# EAGLE design Slave-Mega (EAGLE 9.6.2)
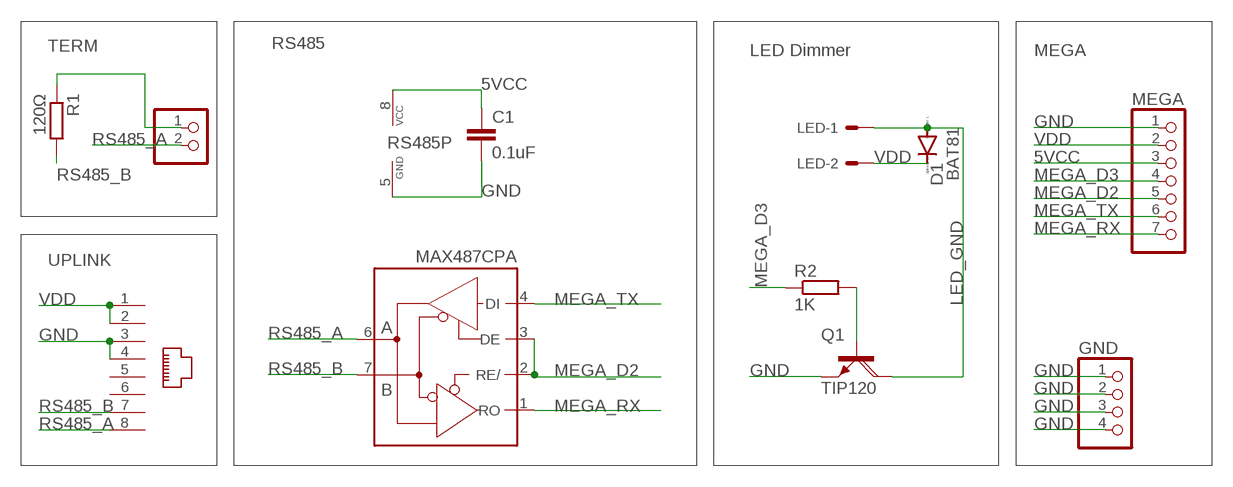
[diagram p0: schematic, sheet 1]

## Parts
C1  0.1uF  C-EU025-025X050  [C025-025X050]
D1  BAT81  [DO34-7]
GND  PINHD-1X4  [1X04]
LED  KK-156-2  [KK-156-2]
MEGA  PINHD-1X7  [1X07]
Q1  TIP120  [TO220AH]
R1  120Ω  R-EU_0204/7  [0204/7]
R2  1K  R-EU_0204/7  [0204/7]
RS485  MAX487CPA  [DIL08]
TERM  PINHD-1X2  [1X02]
UPLINK  RJ45-8P8C  [RJ45-8P8C]

## Nets
5VCC: C1.1 MEGA.3 RS485.8(VCC)
GND: C1.2 GND.1 GND.2 GND.3 GND.4 MEGA.1 Q1.E RS485.5(GND) UPLINK.3 UPLINK.4
LED_GND: D1.A LED.1 Q1.C
LED_PWM: Q1.B R2.2
MEGA_D2: MEGA.5 RS485.2(RE/) RS485.3(DE)
MEGA_D3: MEGA.4 R2.1
MEGA_RX: MEGA.7 RS485.1(RO)
MEGA_TX: MEGA.6 RS485.4(DI)
RS485_A: RS485.6(A) TERM.2 UPLINK.8
RS485_B: R1.2 RS485.7(B) UPLINK.7
TERM: R1.1 TERM.1
VDD: D1.C LED.2 MEGA.2 UPLINK.1 UPLINK.2
Unconnected: UPLINK.5 UPLINK.6

## Notes on the sheet
- LED Dimmer | MEGA

## Library data of the parts
C1 = rcl:C-EU: CAPACITOR, European symbol; SPICEPREFIX: C
D1 = diode:BAT81: DIODE barrier diode
GND = pinhead:PINHD-1X4: PIN HEADER
LED = con-molex:KK-156-2: KK 156 HEADER Source: http://www.molex.com/pdm_docs/sd/026604100_sd.pdf; MF: MOLEX; OC_FARNELL: unknown; OC_NEWARK: unknown
MEGA = pinhead:PINHD-1X7: PIN HEADER
Q1 = transistor-power:TIP120: NPN DARLINGTON TRANSISTOR
R1 R2 = rcl:R-EU_: RESISTOR, European symbol; SPICEPREFIX: R
RS485 = A10 Library:MAX487CPA: RS485 TRANSEIVER; MPN: MAX487CPA; OC_FARNELL: unknown; OC_NEWARK: unknown
TERM = pinhead:PINHD-1X2: PIN HEADER
UPLINK = A10 Library:RJ45-8P8C: PCB RJ45 8P8C Femlae Jack/Socket Connector 180 degree vertical https://www.aliexpress.com/item/32918645271.html?spm=a2g0o.order_list.0.0.49471802RMJK7Q

## Net classes
0 default: width 0.406 mm, drill 0.254 mm, clearance 0.406 mm

## Board
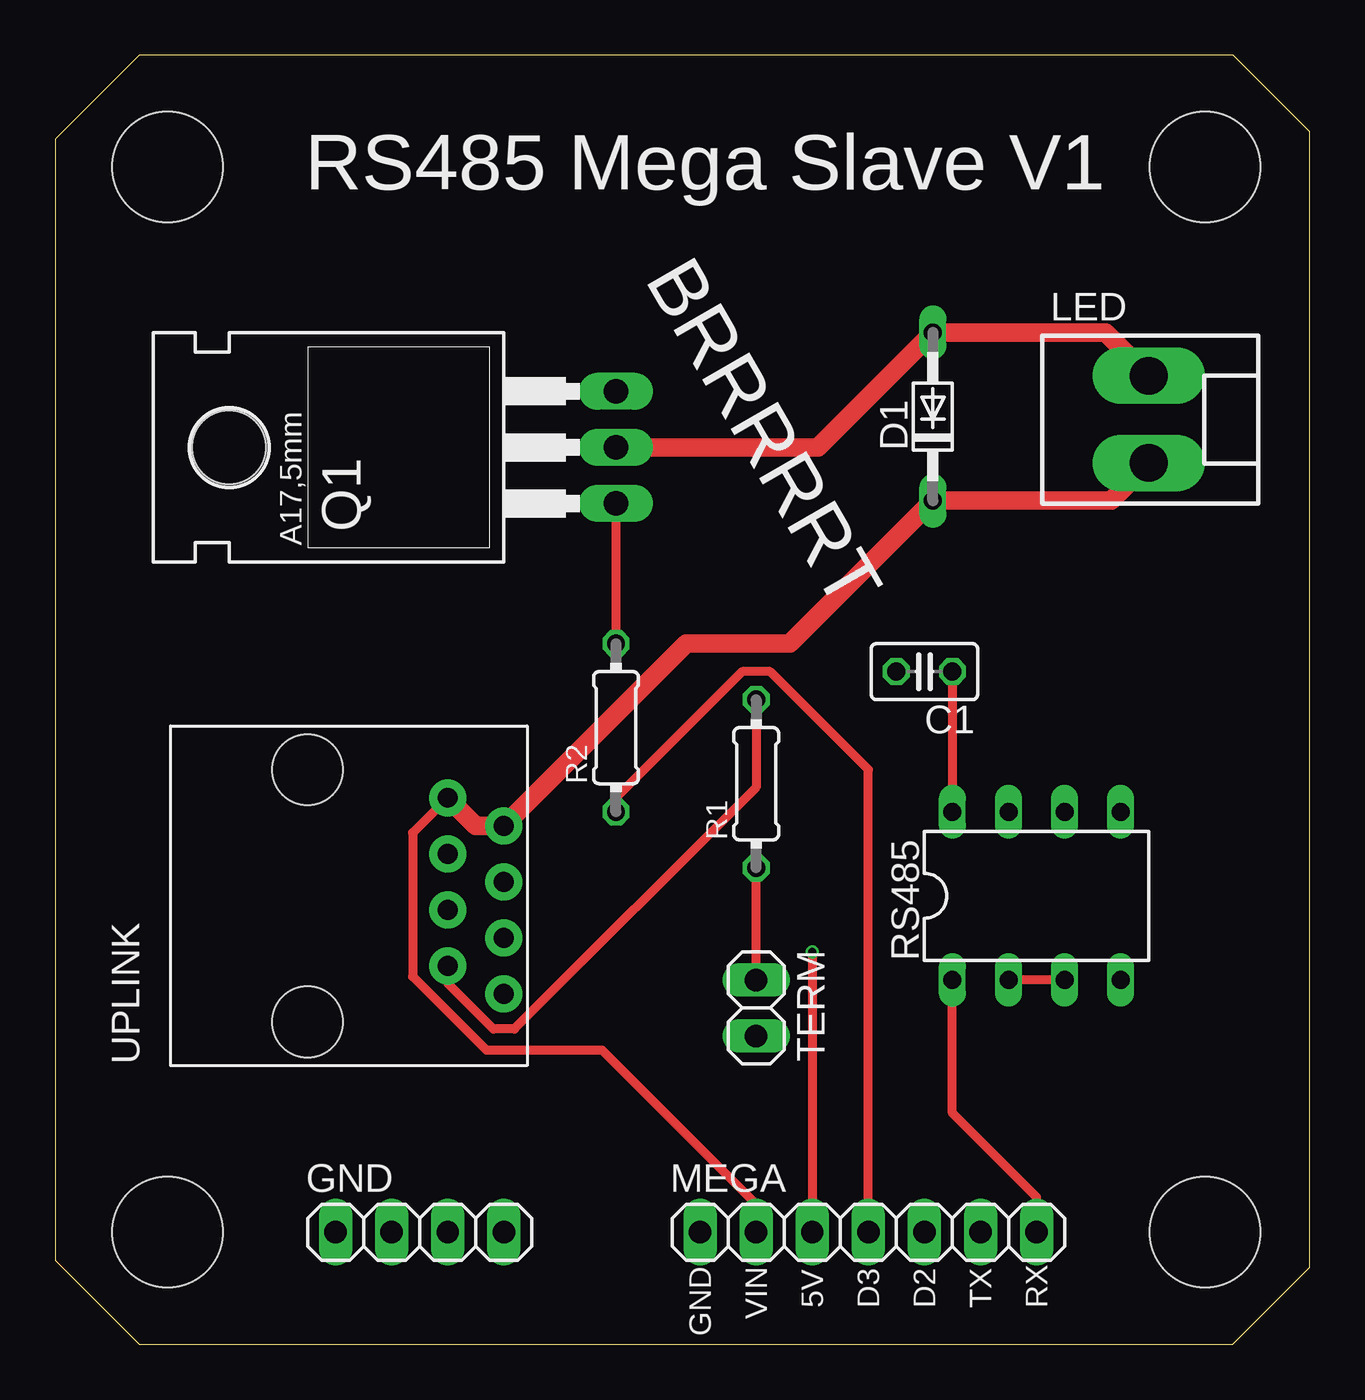
[diagram p1: board, top side]
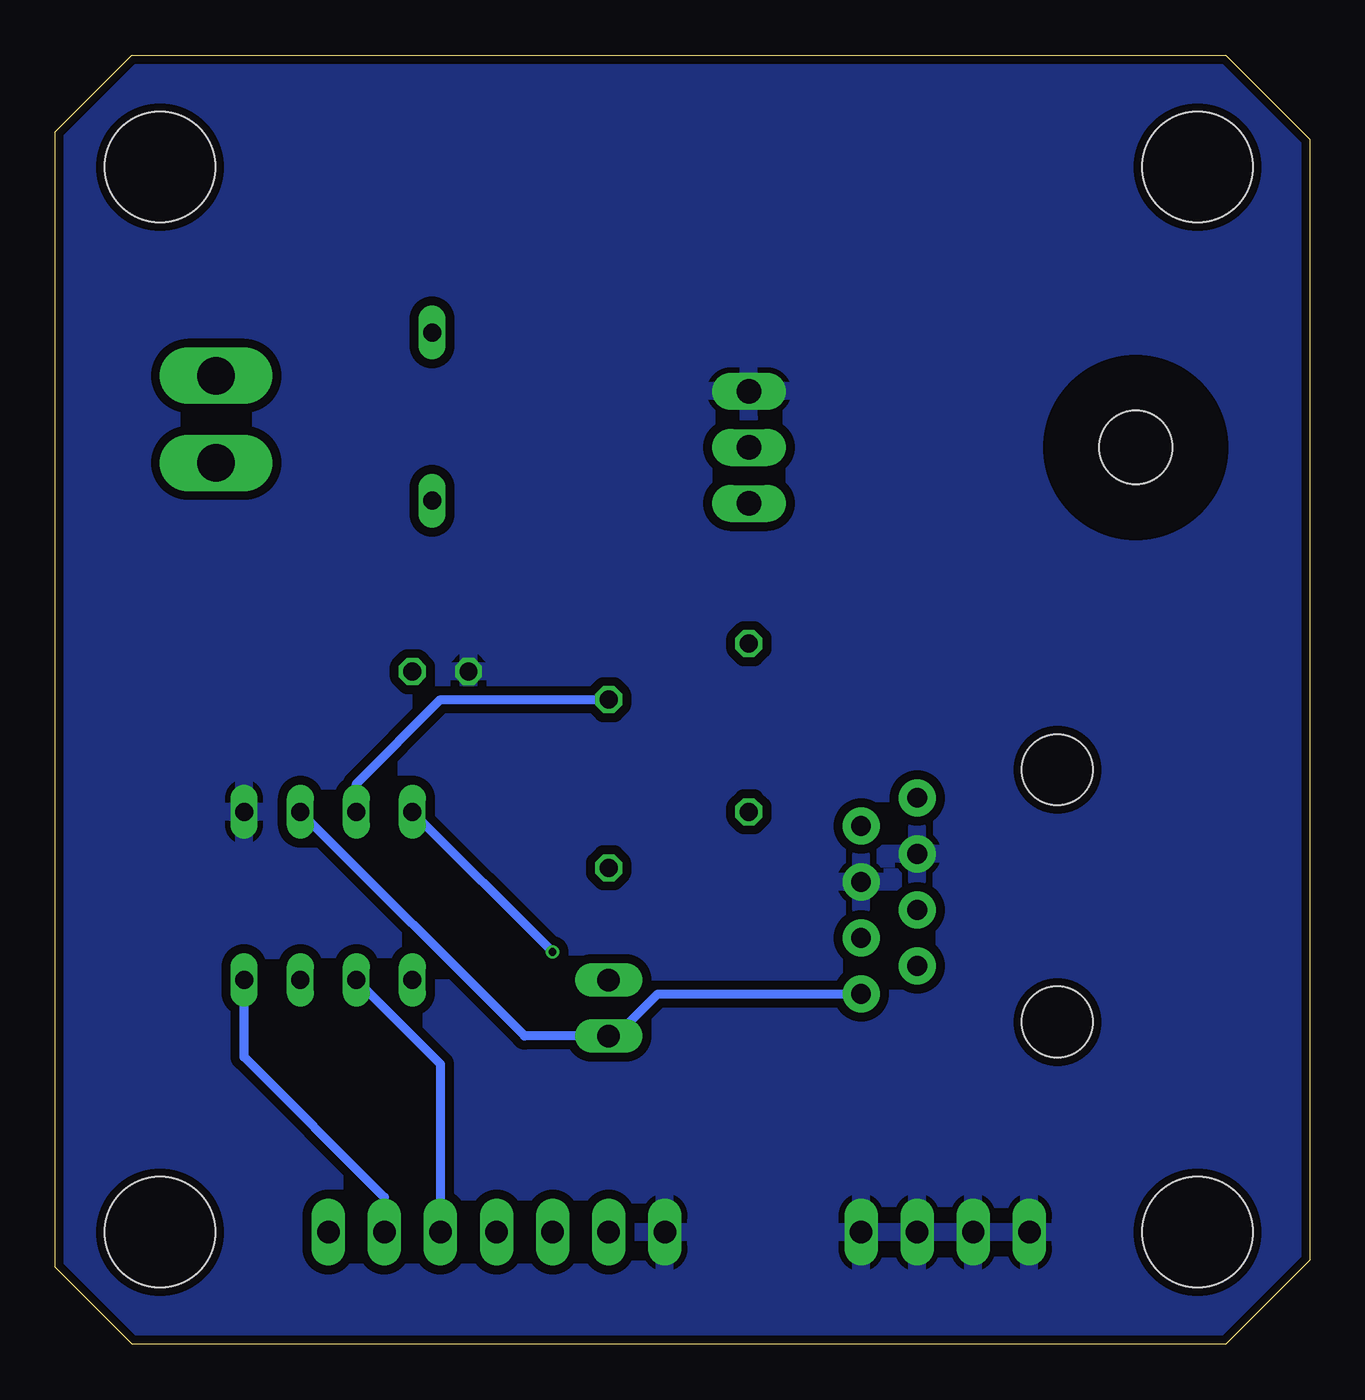
[diagram p2: board, bottom side, seen from below]

Size 56.82 x 58.41 mm. Coordinates in mm from the lower left corner, seen from the top.
Outline: 0,54.61 0,3.81 3.81,0 53.34,0 56.82,3.48 56.82,54.94 53.35,58.41 3.8,58.41 0,54.61
Copper layers (1*16): Top 0.035559375mm / dielectric 1.6mm / Bottom 0.035559375mm
Design rules "oshpark-2layer": minimum track width 6mil, minimum drill 10mil, track to track 6mil, track to pad 6mil, pad to pad 6mil, via to via 6mil, smd to smd 6mil, copper to edge 15mil, drill to drill 6mil, minimum pad ring 5mil, minimum via ring 5mil, stop-mask expansion 2.5mil, vias tented up to drill 0mil, thermal gap 10mil
Holes 5 mm at 5.08,5.08 5.08,53.34 52.07,5.08 52.07,53.34

### Footprints (pad centres in the part's own frame; a part is rotated, then mirrored left to right if it is on the bottom)
C025-025X050 = drill 0.813 octagon: 1 -1.27,0; 2 1.27,0
DO34-7 = drill 0.813 long: A 3.81,0; C -3.81,0
1X04 = drill 1.016 long: 1 -3.81,0; 2 -1.27,0; 3 1.27,0; 4 3.81,0
KK-156-2 = drill 1.7 pad 2.184 long: 1 -1.98,0; 2 1.98,0
1X07 = drill 1.016 long: 1 -7.62,0; 2 -5.08,0; 3 -2.54,0; 4 0,0; 5 2.54,0; 6 5.08,0; 7 7.62,0
TO220AH = drill 1.118 long: B -2.54,-6.35; C 0,-6.35; E 2.54,-6.35 | hole 3.302: 0,11.176
0204/7 = drill 0.813 octagon: 1 -3.81,0; 2 3.81,0
DIL08 = drill 0.813 long: 1 -3.81,-3.81; 2 -1.27,-3.81; 3 1.27,-3.81; 4 3.81,-3.81; 5 3.81,3.81; 6 1.27,3.81; 7 -1.27,3.81; 8 -3.81,3.81
1X02 = drill 1.016 long: 1 -1.27,0; 2 1.27,0
RJ45-8P8C = drill 0.9 pad 1.676: 1 4.445,-6.35; 2 3.175,-8.89; 3 1.905,-6.35; 4 0.635,-8.89; 5 -0.635,-6.35; 6 -1.905,-8.89; 7 -3.175,-6.35; 8 -4.445,-8.89 | hole 3.2: -5.715,0; 5.715,0

### Placement (x,y rotation side)
C1  39.37,30.48 180 top
D1  39.75,42.04 90 top
GND  16.51,5.08 0 top
LED  49.53,41.91 270 top
MEGA  36.83,5.08 0 top
Q1  19.05,40.64 90 top
R1  31.75,25.4 90 top
R2  25.4,27.94 90 top
RS485  44.45,20.32 0 top
TERM  31.75,15.24 270 top
UPLINK  11.43,20.32 90 top

### Tracks (layer width: path | path; a pad name or v marks a point on that pad's centre or on a via)
5VCC  (via drill 0.35)
  Top 0.406: C1.1 RS485.8 | v34.29,17.78 MEGA.3
  Bottom 0.406: RS485.8 v34.29,17.78
GND
  pour Bottom: -1.27,59.69 58.42,59.69 58.42,-1.27 -1.27,-1.27
LED_GND
  Top 0.838: Q1.C 34.54,40.64 D1.A 47.57,45.85 LED.1
LED_PWM
  Top 0.406: Q1.B R2.2
MEGA_D2
  Top 0.406: RS485.3 RS485.2
  Bottom 0.406: MEGA.5 39.37,12.7 RS485.2
MEGA_D3
  Top 0.406: R2.1 25.4,24.77 31.11,30.48 32.38,30.48 36.83,26.04 MEGA.4
MEGA_RX
  Top 0.406: RS485.1 40.64,10.48 44.45,6.67 MEGA.7
MEGA_TX
  Bottom 0.406: RS485.4 48.26,13.02 41.91,6.67 MEGA.6
RS485_A
  Bottom 0.406: RS485.6 35.56,13.97 TERM.2 31.43,13.97 29.53,15.88 UPLINK.8
RS485_B
  Top 0.406: UPLINK.7 17.78,16.35 19.84,14.29 20.8,14.29 31.75,25.24 R1.2
  Bottom 0.406: R1.2 39.37,29.21 43.18,25.4 RS485.7
TERM
  Top 0.406: TERM.1 R1.1
VDD
  Top 0.406: MEGA.2 31.75,6.35 24.77,13.34 19.53,13.34 16.19,16.67 16.19,23.18 UPLINK.1
  Top 0.838: LED.2 47.83,38.23 D1.C 33.27,31.75 28.57,31.75 UPLINK.2 19.05,23.5 UPLINK.1

### Text on the board
tNames: RS485 Mega Slave V1 | BRRRRRT | 5V | D3 | D2 | TX | RX | VIN | GND